# EAGLE design waterius-factory-3.0 (EAGLE 9.0.1)
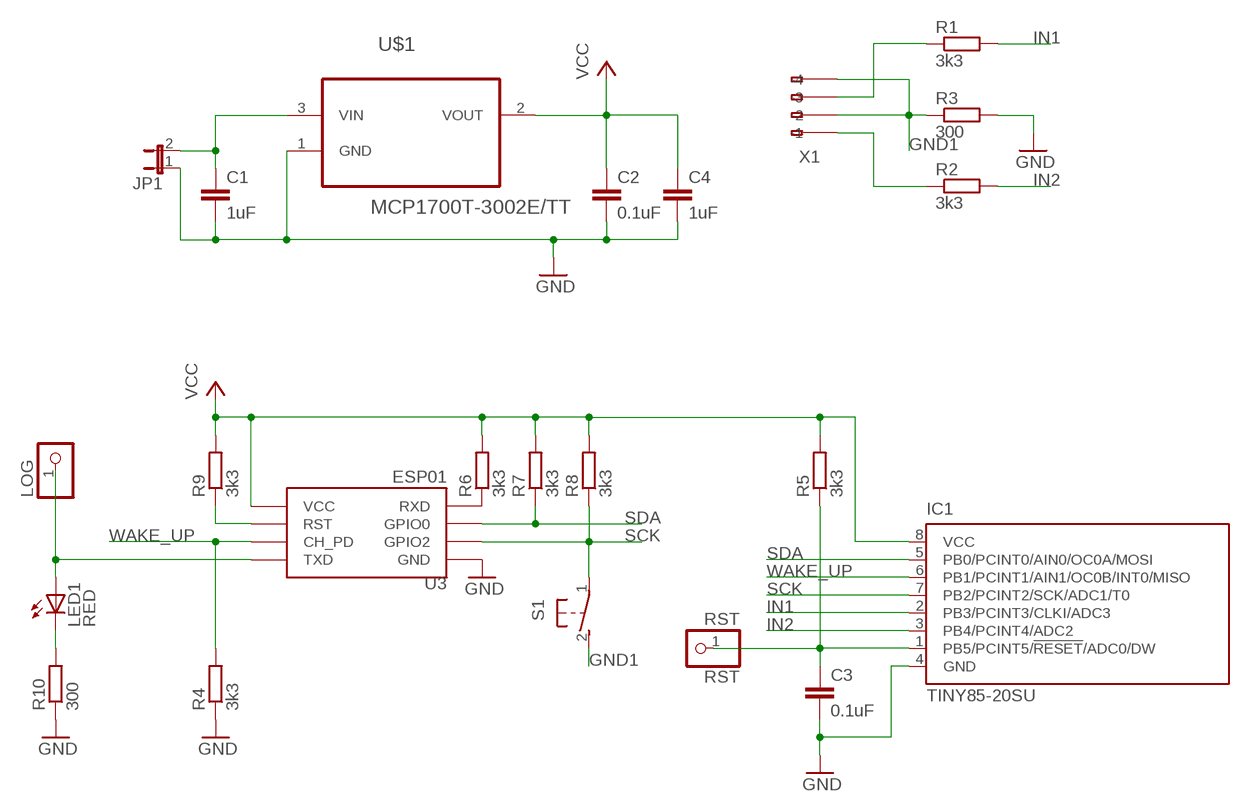
[diagram p0: schematic, sheet 1]

## Parts
C1  1uF  C-EUC0805  [C0805]
C2  0.1uF  C-EUC0805  [C0805]
C3  0.1uF  C-EUC0805  [C0805]
C4  1uF  C-EUC0805  [C0805]
IC1  TINY85-20SU  TINY13-20SU  [8S2]
JP1  JP1E  [JP1]
LED1  RED  LED3MM  [LED3MM]
LOG  PINHD-1X1  [1X01]
R1  3k3  R-EU_R0805  [R0805]
R2  3k3  R-EU_R0805  [R0805]
R3  300  R-EU_R0805  [R0805]
R4  3k3  R-EU_R0805  [R0805]
R5  3k3  R-EU_R0805  [R0805]
R6  3k3  R-EU_R0805  [R0805]
R7  3k3  R-EU_R0805  [R0805]
R8  3k3  R-EU_R0805  [R0805]
R9  3k3  R-EU_R0805  [R0805]
R10  300  R-EU_R0805  [R0805]
RST  RST  PINHD-1X1  [1X01]
S1  31-XX  [B3F-31XX]
U3  ESP01  [ESP01]
U$1  MCP1700T-3002E/TT  [SOT95P237X112-3N]
X1  233-104  [233-104]

## Nets
+3V: C2.1 C4.1 IC1.8(VCC) R5.2 R6.2 R7.2 R8.2 R9.2 U3.VCC U$1.2(VOUT) ; supply symbol labelled VCC
GND: C1.2 C2.2 C3.2 C4.2 IC1.4(GND) JP1.1 R3.2 R4.1 R10.1 U3.GND U$1.1(GND)
GND1: R3.1 S1.2(S) X1.A2(-2) X1.A4(-4)
IN1: IC1.2(PB3/PCINT3/CLKI/ADC3) R1.2
IN2: IC1.3(PB4/PCINT4/ADC2) R2.2
N$1: C1.1 JP1.2 U$1.3(VIN)
N$2: R6.1 U3.RX(RXD)
N$3: R9.1 U3.RST
N$4: C3.1 IC1.1(PB5/PCINT5/!RESET!/ADC0/DW) R5.1 RST.1
N$5: LED1.A LOG.1 U3.TX(TXD)
N$6: LED1.K(C) R10.2
N$7: R1.1 X1.A3(-3)
N$8: R2.1 X1.A1(-1)
SCK: IC1.7(PB2/PCINT2/SCK/ADC1/T0) R8.1 S1.1(P) U3.GPIO2
SDA: IC1.5(PB0/PCINT0/AIN0/OC0A/MOSI) R7.1 U3.GPIO0
WAKE_UP: IC1.6(PB1/PCINT1/AIN1/OC0B/INT0/MISO) R4.2 U3.CH_PD
Unconnected: X1.B1(B-1) X1.B2(B-2) X1.B3(B-3) X1.B4(B-4)

## Library data of the parts
C1-C4 = rcl:C-EU: CAPACITOR, European symbol; SPICEPREFIX: C
IC1 = atmel:TINY13: 8-bit AVR Microcontroller with 1K Bytes In-System Programmable Flash Source: http://www.atmel.com/dyn/resources/prod_documents/2535S.pdf; MPN: ATTINY13-20SU; OC_FARNELL: 9171568; OC_NEWARK: 96K6522
JP1 = jumper:JP1E: JUMPER
LED1 = led:LED: LED OSRAM: - CHIPLED LG R971, LG N971, LY N971, LG Q971, LY Q971, LO R971, LY R971 LH N974, LH R974 LS Q976, LO Q976, LY Q976 LO Q996 - Hyper CHIPLED LW Q18S LB Q993, LB Q99A, LB R99A - SideLED LS A670, LO A670, LY A670, LG A670, LP A670 LB A673, LV A673, LT A673, LW A673 LH A674 LY A675 LS A676, LA A676, LO A676, LY A676, LW A676 LS A679, LY A679, LG A679 - Hyper Micro SIDELED® LS Y876, LA Y876, LO Y876, LY Y876 LT Y87S - SmartLED LW L88C, LW L88S LB L89C, LB L89S, LG L890 LS L89K, LO L89K, LY L89K LS L896, LA L896, LO L896, LY L896 - TOPLED LS T670, LO T670, LY T670, LG T670, LP T670 LSG T670, LSP T670, LSY T670, LOP T670, LYG T670 LG T671, LOG T671, LSG T671 LB T673, LV T673, LT T673, LW T673 LH T674 LS T676, LA T676, LO T676, LY T676, LB T676, LH T676, LSB T676, LW T676 LB T67C, LV T67C, LT T67C, LS T67K, LO T67K, LY T67K, LW E67C LS E67B, LA E67B, LO E67B, LY E67B, LB E67C, LV E67C, LT E67C LW T67C LS T679, LY T679, LG T679 LS T770, LO T770, LY T770, LG T770, LP T770 LB T773, LV T773, LT T773, LW T773 LH T774 LS E675, LA E675, LY E675, LS T675 LS T776, LA T776, LO T776, LY T776, LB T776 LHGB T686 LT T68C, LB T68C - Hyper Mini TOPLED® LB M676 - Mini TOPLED Santana® LG M470 LS M47K, LO M47K, LY M47K Source: http://www.osram.convergy.de LUXEON: - LUMILED® LXK2-PW12-R00, LXK2-PW12-S00, LXK2-PW14-U00, LXK2-PW14-V00 LXK2-PM12-R00, LXK2-PM12-S00, LXK2-PM14-U00 LXK2-PE12-Q00, LXK2-PE12-R00, LXK2-PE12-S00, LXK2-PE14-T00, LXK2-PE14-U00 LXK2-PB12-K00, LXK2-PB12-L00, LXK2-PB12-M00, LXK2-PB14-N00, LXK2-PB14-P00, LXK2-PB14-Q00 LXK2-PR12-L00, LXK2-PR12-M00, LXK2-PR14-Q00, LXK2-PR14-R00 LXK2-PD12-Q00, LXK2-PD12-R00, LXK2-PD12-S00 LXK2-PH12-R00, LXK2-PH12-S00 LXK2-PL12-P00, LXK2-PL12-Q00, LXK2-PL12-R00 Source: www.luxeon.com KINGBRIGHT: KA-3528ASYC Source: www.kingbright.com
LOG RST = pinhead:PINHD-1X1: PIN HEADER
R1-R10 = resistor:R-EU_: RESISTOR, European symbol
S1 = switch-omron:31-XX: OMRON SWITCH; MPN: B3F-3100; OC_FARNELL: 959704; OC_NEWARK: 36M3582
U3 = esp8266modules:ESP01: ESP8266 Wifi module 01
U$1 = MCP1700T-3002E_TT:MCP1700T-3002E/TT: Low Quiescent Current LDO; AVAILABILITY: Unavailable; DESCRIPTION: MCP1700 Series 250 mA 3 V Fixed Output LDO Voltage Regulator - SOT-23; MF: Microchip; MP: MCP1700T-3002E/TT; PACKAGE: SOT-23 Microchip; PRICE: None
X1 = con-wago255:233-104: WAGO; MPN: 233-104; OC_FARNELL: unknown; OC_NEWARK: 28K9046

## Net classes
0 default: clearance 0.205 mm

## Board
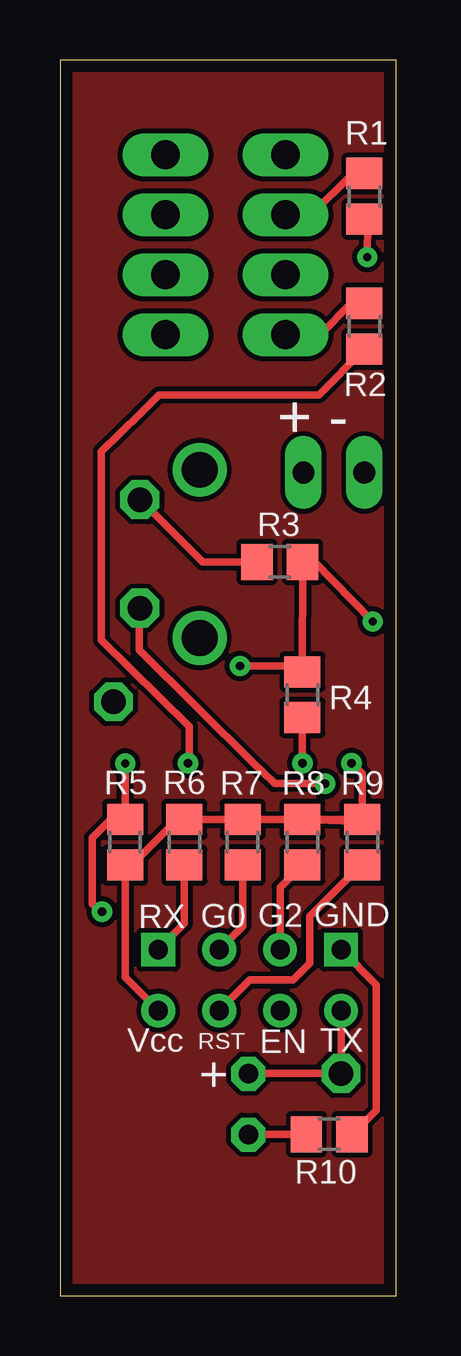
[diagram p1: board, top side]
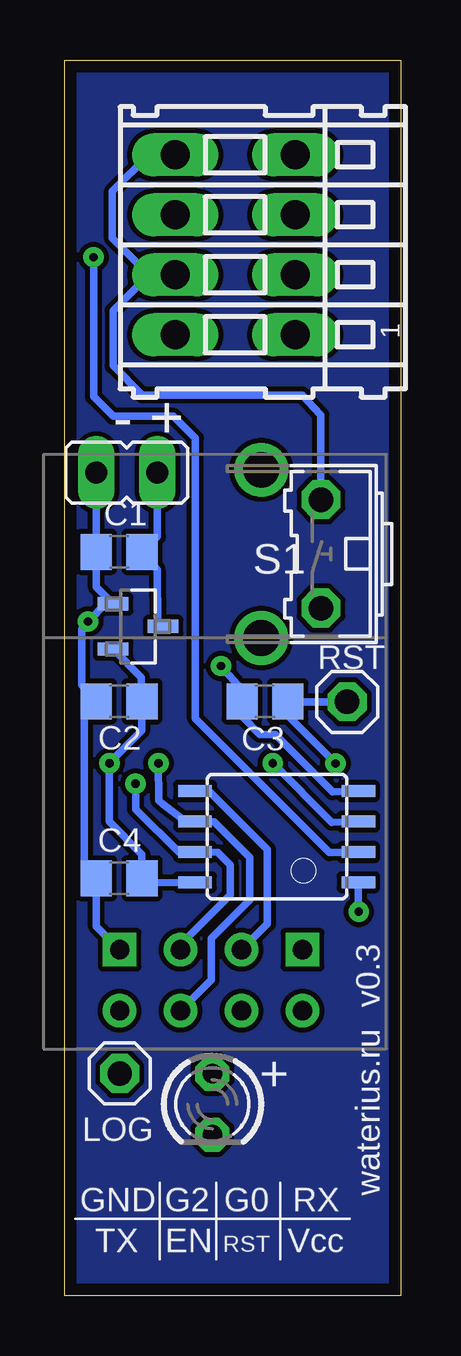
[diagram p2: board, bottom side, seen from below]

Size 14 x 51.5 mm. Coordinates in mm from the lower left corner, seen from the top.
Outline: 0,0 14,0 14,51.5 0,51.5 0,0
Copper layers (1*16): Top 0.035mm / dielectric 1.5mm / Bottom 0.035mm
Design rules "my *": minimum track width 0.25mm, minimum drill 0.3mm, track to track 0.2mm, track to pad 0.2mm, pad to pad 0.2mm, via to via 0.2mm, smd to smd 6mil, copper to edge 0.5mm, drill to drill 0.2mm, minimum pad ring 0.3mm, minimum via ring 0.25mm, stop-mask expansion 4mil, vias tented up to drill 0mil, thermal gap 10mil

### Footprints (pad centres in the part's own frame; a part is rotated, then mirrored left to right if it is on the bottom)
C0805 = smd 1.3 x 1.5: 1 -0.95,0; 2 0.95,0
8S2 = smd 0.5 x 1.4: 1 -1.905,-3.404; 2 -0.645,-3.404; 3 0.625,-3.404; 4 1.895,-3.404; 5 1.905,3.404; 6 0.635,3.404; 7 -0.635,3.404; 8 -1.905,3.404
JP1 = drill 0.914 long: 1 0,-1.27; 2 0,1.27
LED3MM = drill 0.813 octagon: A -1.27,0; K 1.27,0
1X01 = drill 1.016 octagon: 1 0,0
R0805 = smd 1.3 x 1.5: 1 -0.95,0; 2 0.95,0
B3F-31XX = drill 1.016 octagon: 1 -2.261,-1.245; 2 2.261,-1.245 | drill 1.499 pad 2.159: 3 -3.505,1.245; 4 3.505,1.245
ESP01 = drill 0.8: CH_PD -1.285,-8.178; GPIO0 1.255,-5.638; GPIO2 -1.285,-5.638; RST 1.255,-8.178; TX -3.825,-8.178; VCC 3.795,-8.178 | drill 0.8 square: GND -3.825,-5.638; RX 3.795,-5.638
SOT95P237X112-3N = smd 0.559 x 1.27: 1 -0.94,-1.041; 2 0.94,-1.041; 3 0,1.041
233-104 = drill 1.2 long: A1 -3.75,2.5; A2 -1.25,2.5; A3 1.25,2.5; A4 3.75,2.5; B1 -3.75,-2.5; B2 -1.25,-2.5; B3 1.25,-2.5; B4 3.75,-2.5

### Placement (x,y rotation side)
C1  11.73,30.99 180 bottom
C2  11.73,24.77 180 bottom
C3  5.66,24.76 180 bottom
C4  11.73,17.39 180 bottom
IC1  5.17,19.13 90 bottom
JP1  11.41,34.31 270 bottom
LED1  7.85,7.97 270 bottom
LOG  11.71,9.26 0 bottom
R1  12.68,45.82 270 top
R2  12.68,40.4 270 top
R3  9.16,30.57 0 top
R4  10.1,25.04 270 top
R5  2.72,18.89 270 top
R6  5.18,18.89 90 top
R7  7.61,18.89 90 top
R8  10.1,18.89 90 top
R9  12.6,18.89 90 top
R10  11.22,6.72 180 top
RST  2.23,24.75 0 bottom
S1  4.57,30.91 90 bottom
U3  7.89,20.05 0 bottom
U$1  10.95,27.89 270 bottom
X1  6.9,43.8 90 bottom

### Tracks (layer width: path | path; a pad name or v marks a point on that pad's centre or on a via)
+3V  (via drill 0.35)
  Top 0.305: R9.2 R7.2 R6.2 4.88,19.84 3.23,18.19 2.96,18.19 R5.2 2.72,13.25 U3.VCC | R9.2 11.78,19.78 R8.2 | R9.2 11.84,19.84 | v12.14,22.19 12.6,21.77 12.6,20.52 R9.2
  Bottom 0.305: U$1.2 10.81,25.77 C2.1 10.79,24 10.79,23.55 v12.14,22.19 12.14,19.76 10.78,18.38 C4.1 | IC1.8 10.44,17.2 C4.1 | 10.95,17.08 C4.1
GND  (via drill 0.35)
  Top 0.305: U3.GND 13.18,12.95 13.18,7.72 12.18,6.72 R10.1 | R4.1 9.89,26.24 v7.49,26.24 | R4.1 R3.2 10.57,30.61 v13.03,28.09 | 10.09,25.97 R4.1
  Bottom 0.305: U3.GND 12.68,15.39 C4.2 13.18,17.89 13.18,24.27 C2.2 13.28,25.44 13.28,27.79 13.08,28.04 v13.03,28.09 12.27,28.85 U$1.1 12.68,29.52 C1.2 | IC1.4 2.83,21 5.23,23.39 5.87,23.39 6.61,24.14 C3.2 6.61,25.23 v7.49,26.24 | 12.7,31.6 12.7,30.91 C1.2 | C1.2 JP1.1
GND1
  Top 0.305: R3.1 5.95,30.58 3.35,33.17 S1.2
  Bottom 0.305: 10.49,42.55 12.01,44.07 12.01,46.02 10.49,47.55 X1.A4 | X1.A2 10.49,42.55 | 10.49,42.55 11.99,41.05 11.99,38.76 10.77,37.54 4.12,37.54 3.35,36.73 3.33,36.7 S1.2
IN1  (via drill 0.35)
  Top 0.305: R1.2 12.83,44.78 v12.8,43.28
  Bottom 0.305: IC1.2 1.67,18.47 2.97,18.47 8.56,24.05 8.56,35.74 9.47,36.65 11.99,36.65 12.8,37.47 v12.8,43.28
IN2  (via drill 0.35)
  Top 0.305: R2.2 10.77,37.54 4.12,37.54 3.34,36.77 1.73,35.18 1.73,27.33 5.38,23.72 5.38,22.24 v5.33,22.19
  Bottom 0.305: v5.33,22.19 2.89,19.73 IC1.3
N$1
  Bottom 0.305: U$1.3 10.13,27.94 10.15,30.27 C1.1 10.14,31.63 JP1.2
N$2
  Top 0.305: R6.1 5.18,15.51 U3.RX
N$3
  Top 0.305: U3.RST 7.92,13.16 9.73,13.16 10.41,13.84 10.41,15.8 12.56,17.94 R9.1
N$4  (via drill 0.35)
  Top 0.305: v2.72,22.18 R5.1 2.11,19.84 1.35,19.07 1.35,16.33 v1.75,16
  Bottom 0.305: 1.55,17.22 IC1.1 1.76,15.99 v1.75,16 | v2.72,22.18 4.71,24.17 C3.1 4.69,24.75 RST.1
N$5
  Top 0.305: LED1.A 7.86,9.26 LOG.1 11.71,10.65 U3.TX
N$6
  Top 0.305: 10.11,6.7 R10.2 7.87,6.72 LED1.K
N$7
  Top 0.305: X1.A3 10.48,45.05 12.2,46.77 R1.1
N$8
  Top 0.305: X1.A1 10.84,40.05 12.17,41.38 R2.1
N$9
  pour Top: 0,0 14,0 14,51.5 0,51.5
N$11
  pour Bottom: 0,0 14,0 14,51.5 0.01,51.51
SCK  (via drill 0.35)
  Top 0.305: R8.1 9.18,17.02 U3.GPIO2 | v11.05,21.34 8.94,21.34 8.43,21.84 8.1,22.15 3.3,26.9 3.3,28.63 S1.1
  Bottom 0.305: U3.GPIO2 9.18,14.62 7.11,16.69 7.11,17.96 7.62,18.47 IC1.7 9.22,18.47 11.05,20.27 v11.05,21.34
SDA
  Top 0.305: R7.1 7.61,15.39 U3.GPIO0
  Bottom 0.305: IC1.5 7.95,20.98 | 7.95,20.98 5.56,18.59 5.56,15.49 U3.GPIO0 | 7.95,20.98 8.64,21.03
WAKE_UP  (via drill 0.35)
  Top 0.305: v10.1,22.19 R4.2
  Bottom 0.305: U3.CH_PD 7.9,13.15 7.9,14.88 6.3,16.48 6.3,18.26 7.77,19.74 IC1.6 8.94,19.74 9.91,20.47 10.08,20.63 v10.1,22.19

### Text on the board
tNames: + - | RX | G0 | G2 | GND | Vcc | RST | EN | TX | +
bNames: - + | v0.3 | waterius.ru | + | RX | G0 | G2 | GND | Vcc | RST | EN | TX